# Altium project FM110236A.PrjPCB
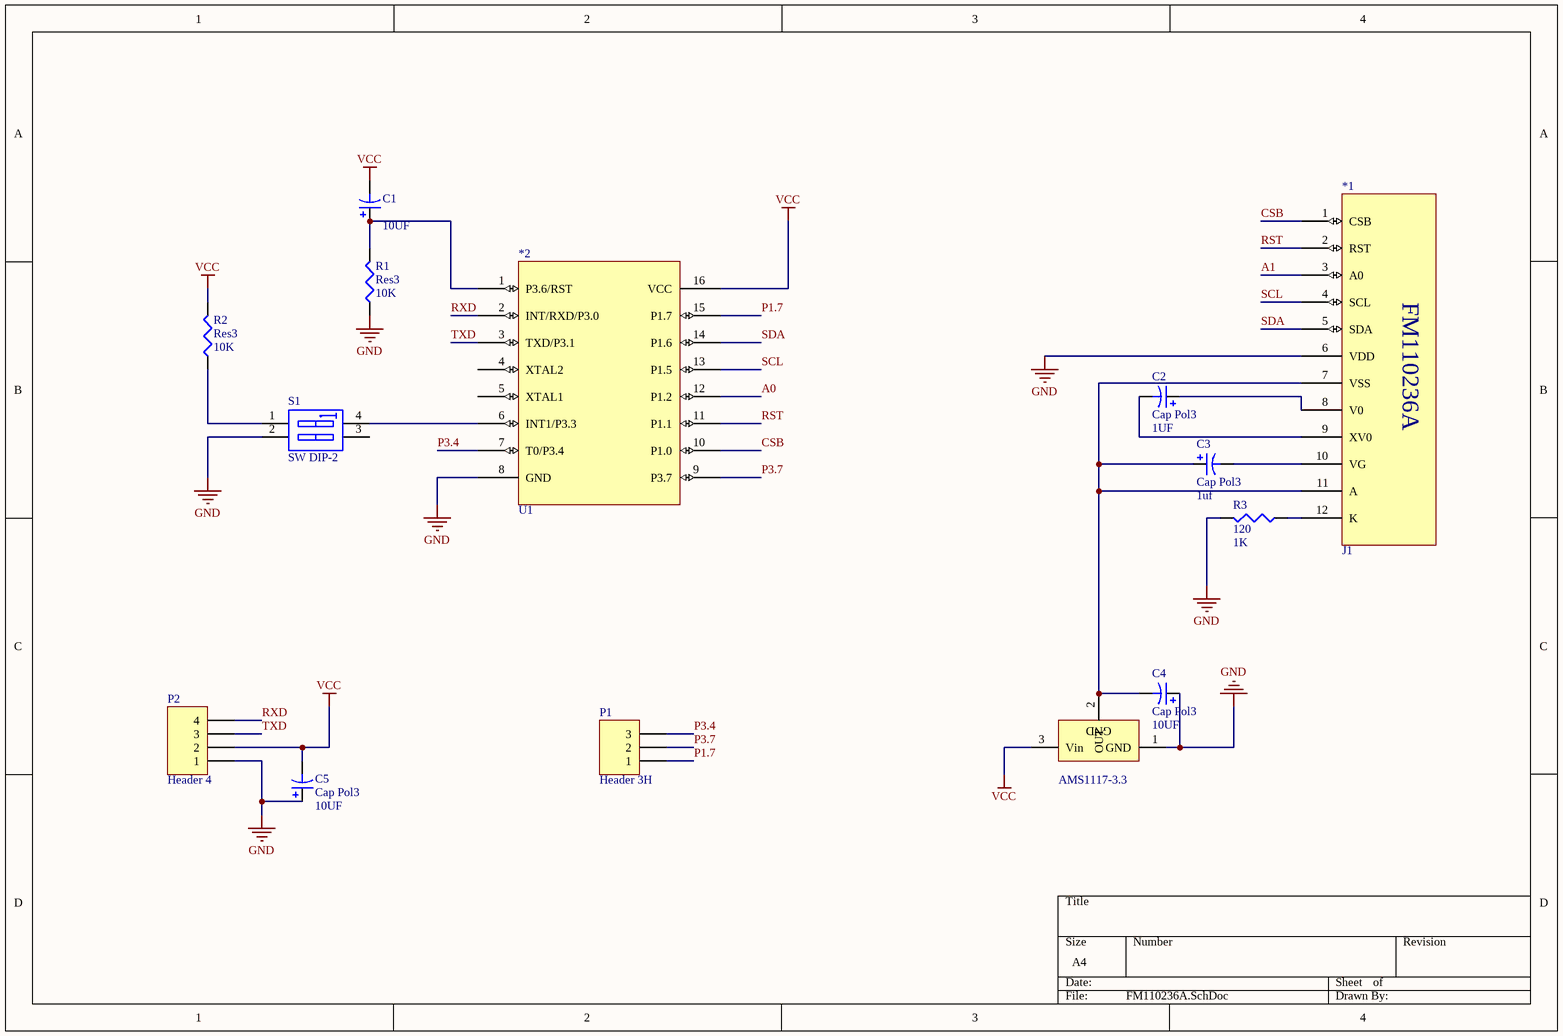
[diagram p0: FM110236A.SchDoc]
1 sheet, 14 parts. Net scope: global (net labels, ports and power ports of the same name join across sheets).
Board file: testboard.PcbDoc

## Sheet FM110236A.SchDoc
size A4

### Parts
*1  J1  [PCBComponent_1]
*2  U1  [TSOP127P620X160-16N]
C1  value 10UF  [C0805]
C2  Cap Pol3  value 1UF  [C0805]
C3  Cap Pol3  value 1uf  [C0805]
C4  Cap Pol3  value 10UF  [C0805]
C5  Cap Pol3  value 10UF  [C0805]
P1  Header 3H  [HDR1X3H]
P2  Header 4  [HDR1X4]
R1  Res3  value 10K  [J1-0603]
R2  Res3  value 10K  [J1-0603]
R3  120  value 1K  [J1-0603]
S1  SW DIP-2  [DIP-4]
VR1  AMS1117-3.3  [SOT223_L]

### Nets
GND: *1.6(VDD) *2.8(GND) C4.1 C5.1 P2.1 R1.1 R3.2 S1.2(A2) VR1.1(GND)
VCC: *2.16(VCC) C1.2 C5.2 P2.2 R2.2 VR1.3(Vin)
A0: *2.12(P1.2)
A1: *1.3(A0)
CSB: *1.1(CSB) *2.10(P1.0)
P1.7: *2.15(P1.7) P1.1
P3.4: *2.7(T0/P3.4) P1.3
P3.7: *2.9(P3.7) P1.2
RST: *1.2(RST) *2.11(P1.1)
RXD: *2.2(INT/RXD/P3.0) P2.4
SCL: *1.4(SCL) *2.13(P1.5)
SDA: *1.5(SDA) *2.14(P1.6)
TXD: *2.3(TXD/P3.1) P2.3
Net*1_7: *1.7(VSS) *1.11(A) C3.1 C4.2 VR1.2(OUT)
Net*1_8: *1.8(V0) C2.1
Net*1_9: *1.9(XV0) C2.2
Net*1_10: *1.10(VG) C3.2
Net*1_12: *1.12(K) R3.1
Net*2_1: *2.1(P3.6/RST) C1.1 R1.2
Net*2_6: *2.6(INT1/P3.3) S1.4(B1)
NetR2_1: R2.1 S1.1(A1)

Not connected (* = marked no-connect by the designer): *2 4(XTAL2) 5(XTAL1); S1 3(B2)

### Notes on the sheet
- (in symbol Component_1) FM110236A

### Library data of the parts
*1 = Component_1
*2 = Component_3
C1-C5 = Cap Pol3: Polarized Capacitor (Surface Mount); Published: 8-Jun-2000; LatestRevisionDate: 29-May-2009; LatestRevisionNote: IPC-7351 Footprint Added.; PackageReference: C0805; Publisher: Altium Limited; PackageDescription: Chip Capacitor
P1 = Header 3H: Header, 3-Pin, Right Angle; LatestRevisionDate: 17-Jul-2002; LatestRevisionNote: Re-released for DXP Platform.; Publisher: Altium Limited
P2 = Header 4: Header, 4-Pin; LatestRevisionDate: 17-Jul-2002; LatestRevisionNote: Re-released for DXP Platform.; Publisher: Altium Limited
R1-R3 = Res3: Resistor; Published: 8-Jun-2000; LatestRevisionDate: 29-May-2009; LatestRevisionNote: IPC-7351 Footprint Added.; PackageReference: J1-0603; Publisher: Altium Limited; PackageDescription: Chip Resistor
S1 = SW DIP-2: DIP Switch, 2 Position, SPST; Published: 24-Mar-1999; LatestRevisionDate: 17-Jul-2002; LatestRevisionNote: Re-released for DXP Platform.; PackageReference: DIP-4; Publisher: Altium Limited
VR1 = Volt Reg: Voltage Regulator; Published: 24-Mar-1999; LatestRevisionDate: 29-May-2009; LatestRevisionNote: IPC-7351 Footprint Added.; PackageReference: D2PAK; Publisher: Altium Limited; PackageDescription: 3-Pin Transistor Outline Package 2.54 mm Pitch, 15.1 mm Lead Span